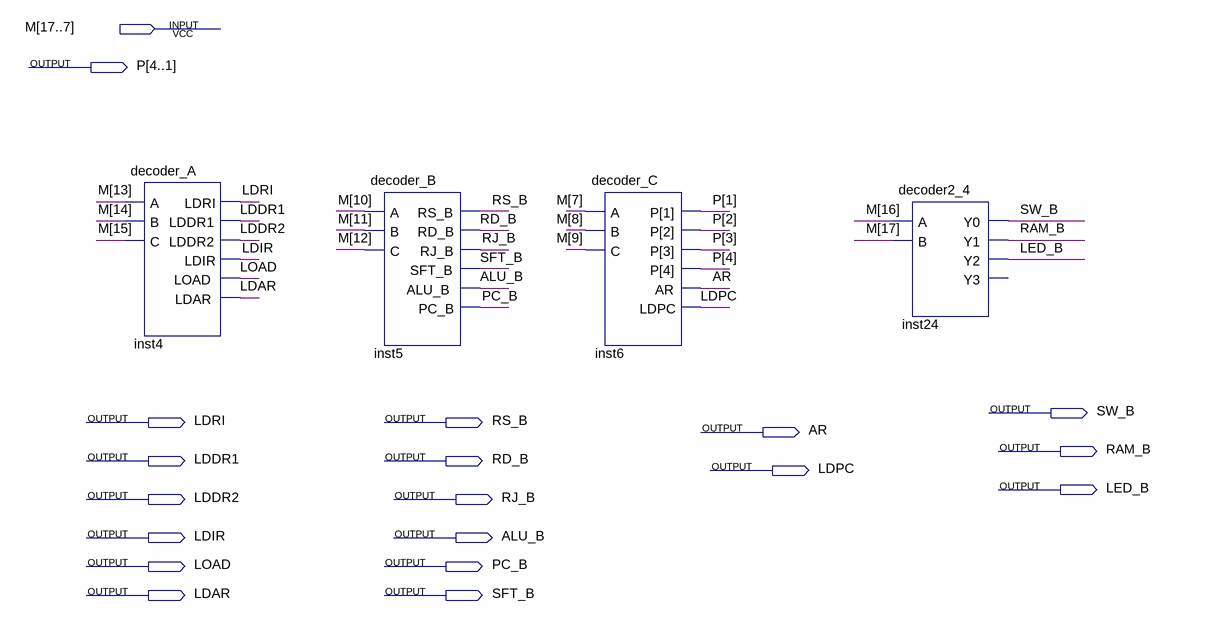
[diagram p0: schematic sheet]
// Quartus schematic decoder_ALL.bdf as structural Verilog: 4 symbols, 19 pins
module decoder_ALL (
  input  [17:7] M,
  output [4:1] P,
  output SW_B,
  output LDRI,
  output RS_B,
  output AR,
  output RAM_B,
  output LDDR1,
  output RD_B,
  output LDPC,
  output LED_B,
  output LDDR2,
  output RJ_B,
  output LDIR,
  output ALU_B,
  output LOAD,
  output PC_B,
  output LDAR,
  output SFT_B
);

  decoder_A inst4 (
    .A(M[13]), .B(M[14]), .C(M[15]), .LDRI(LDRI), .LDDR1(LDDR1), .LDDR2(LDDR2), .LDIR(LDIR), .LOAD(LOAD),
    .LDAR(LDAR));
  decoder_B inst5 (
    .A(M[10]), .B(M[11]), .C(M[12]), .RS_B(RS_B), .RD_B(RD_B), .RJ_B(RJ_B), .SFT_B(SFT_B), .ALU_B(ALU_B),
    .PC_B(PC_B));
  decoder_C inst6 (.A(M[7]), .B(M[8]), .C(M[9]), .P(P), .AR(AR), .LDPC(LDPC));
  decoder2_4 inst24 (.A(M[16]), .B(M[17]), .Y0(SW_B), .Y1(RAM_B), .Y2(LED_B));  // open: Y3
endmodule
